# Altium schematic sheet Sheet1.SchDoc
size A4 portrait
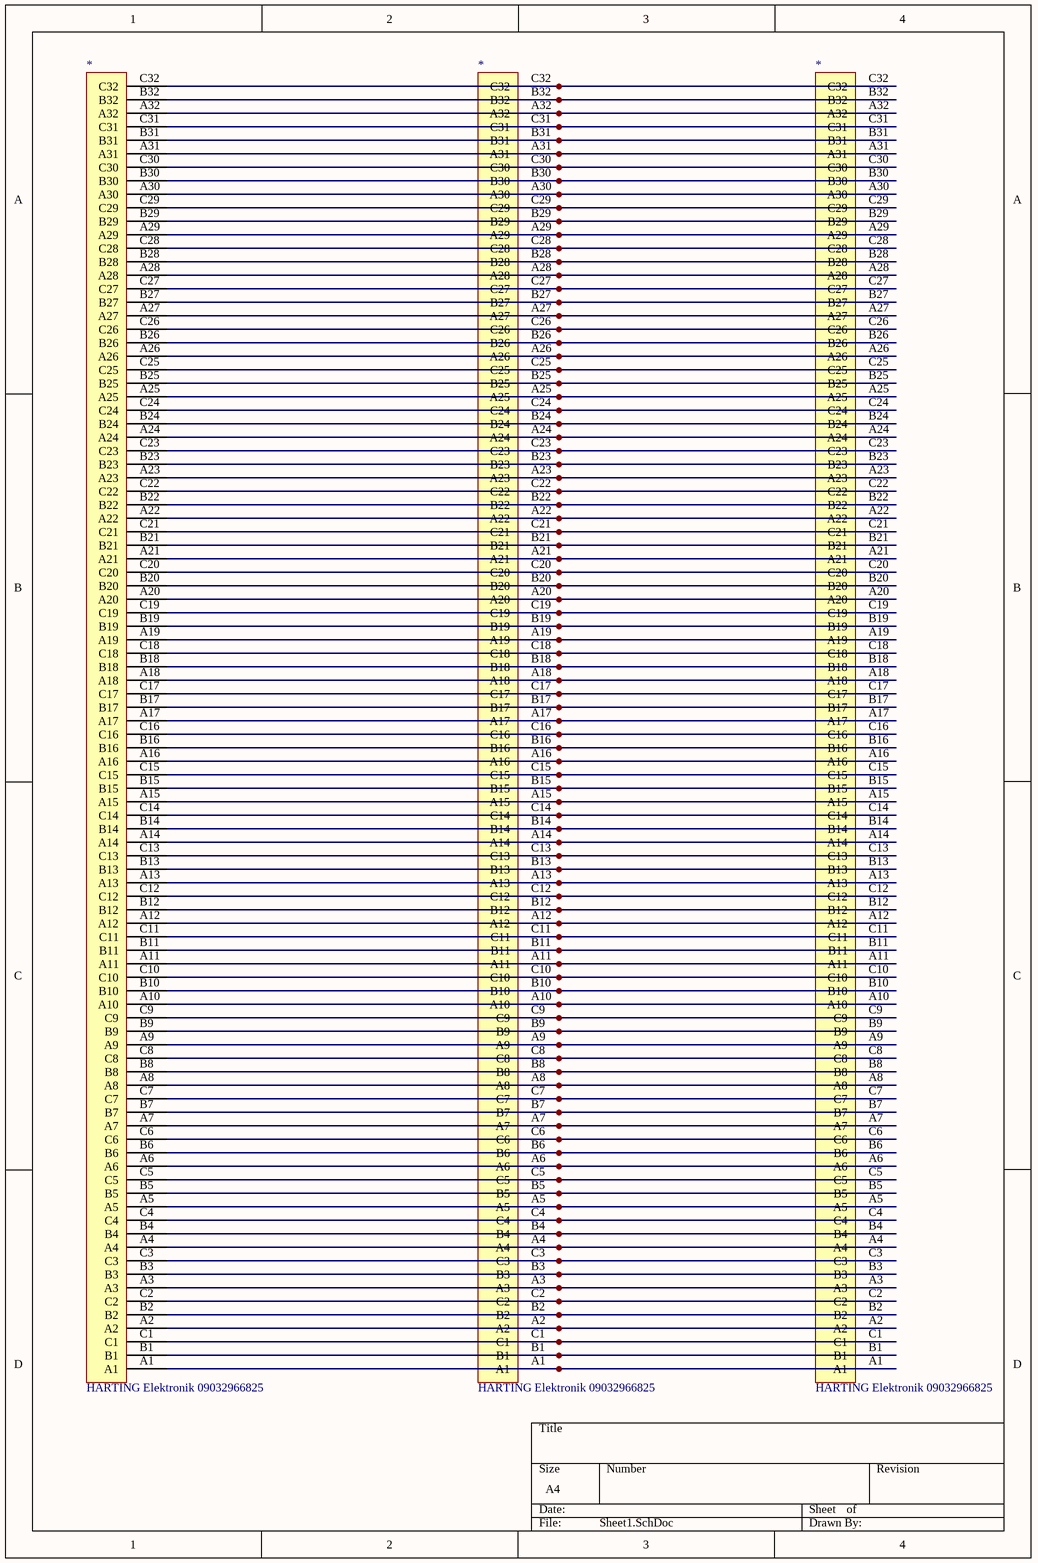
[diagram p0: Sheet1.SchDoc]

## Parts
(Parts that share a designator on the sheet are numbered #1, #2 ... from top to bottom, then left to right.)
*#1  HARTING Elektronik 09032966825  [PCB-fl6umf7voephrqnacxyd-1]
*#2  HARTING Elektronik 09032966825  [PCB-ecf4e4ae5cfbczwsc9zy-1]
*#3  HARTING Elektronik 09032966825  [PCB-ecf4e4ae5cfbczwsc9zy-1]

## Nets
Net*#1_A1: *#1.A1 *#2.A1 *#3.A1
Net*#1_A2: *#1.A2 *#2.A2 *#3.A2
Net*#1_A3: *#1.A3 *#2.A3 *#3.A3
Net*#1_A4: *#1.A4 *#2.A4 *#3.A4
Net*#1_A5: *#1.A5 *#2.A5 *#3.A5
Net*#1_A6: *#1.A6 *#2.A6 *#3.A6
Net*#1_A7: *#1.A7 *#2.A7 *#3.A7
Net*#1_A8: *#1.A8 *#2.A8 *#3.A8
Net*#1_A9: *#1.A9 *#2.A9 *#3.A9
Net*#1_A10: *#1.A10 *#2.A10 *#3.A10
Net*#1_A11: *#1.A11 *#2.A11 *#3.A11
Net*#1_A12: *#1.A12 *#2.A12 *#3.A12
Net*#1_A13: *#1.A13 *#2.A13 *#3.A13
Net*#1_A14: *#1.A14 *#2.A14 *#3.A14
Net*#1_A15: *#1.A15 *#2.A15 *#3.A15
Net*#1_A16: *#1.A16 *#2.A16 *#3.A16
Net*#1_A17: *#1.A17 *#2.A17 *#3.A17
Net*#1_A18: *#1.A18 *#2.A18 *#3.A18
Net*#1_A19: *#1.A19 *#2.A19 *#3.A19
Net*#1_A20: *#1.A20 *#2.A20 *#3.A20
Net*#1_A21: *#1.A21 *#2.A21 *#3.A21
Net*#1_A22: *#1.A22 *#2.A22 *#3.A22
Net*#1_A23: *#1.A23 *#2.A23 *#3.A23
Net*#1_A24: *#1.A24 *#2.A24 *#3.A24
Net*#1_A25: *#1.A25 *#2.A25 *#3.A25
Net*#1_A26: *#1.A26 *#2.A26 *#3.A26
Net*#1_A27: *#1.A27 *#2.A27 *#3.A27
Net*#1_A28: *#1.A28 *#2.A28 *#3.A28
Net*#1_A29: *#1.A29 *#2.A29 *#3.A29
Net*#1_A30: *#1.A30 *#2.A30 *#3.A30
Net*#1_A31: *#1.A31 *#2.A31 *#3.A31
Net*#1_A32: *#1.A32 *#2.A32 *#3.A32
Net*#1_B1: *#1.B1 *#2.B1 *#3.B1
Net*#1_B2: *#1.B2 *#2.B2 *#3.B2
Net*#1_B3: *#1.B3 *#2.B3 *#3.B3
Net*#1_B4: *#1.B4 *#2.B4 *#3.B4
Net*#1_B5: *#1.B5 *#2.B5 *#3.B5
Net*#1_B6: *#1.B6 *#2.B6 *#3.B6
Net*#1_B7: *#1.B7 *#2.B7 *#3.B7
Net*#1_B8: *#1.B8 *#2.B8 *#3.B8
Net*#1_B9: *#1.B9 *#2.B9 *#3.B9
Net*#1_B10: *#1.B10 *#2.B10 *#3.B10
Net*#1_B11: *#1.B11 *#2.B11 *#3.B11
Net*#1_B12: *#1.B12 *#2.B12 *#3.B12
Net*#1_B13: *#1.B13 *#2.B13 *#3.B13
Net*#1_B14: *#1.B14 *#2.B14 *#3.B14
Net*#1_B15: *#1.B15 *#2.B15 *#3.B15
Net*#1_B16: *#1.B16 *#2.B16 *#3.B16
Net*#1_B17: *#1.B17 *#2.B17 *#3.B17
Net*#1_B18: *#1.B18 *#2.B18 *#3.B18
Net*#1_B19: *#1.B19 *#2.B19 *#3.B19
Net*#1_B20: *#1.B20 *#2.B20 *#3.B20
Net*#1_B21: *#1.B21 *#2.B21 *#3.B21
Net*#1_B22: *#1.B22 *#2.B22 *#3.B22
Net*#1_B23: *#1.B23 *#2.B23 *#3.B23
Net*#1_B24: *#1.B24 *#2.B24 *#3.B24
Net*#1_B25: *#1.B25 *#2.B25 *#3.B25
Net*#1_B26: *#1.B26 *#2.B26 *#3.B26
Net*#1_B27: *#1.B27 *#2.B27 *#3.B27
Net*#1_B28: *#1.B28 *#2.B28 *#3.B28
Net*#1_B29: *#1.B29 *#2.B29 *#3.B29
Net*#1_B30: *#1.B30 *#2.B30 *#3.B30
Net*#1_B31: *#1.B31 *#2.B31 *#3.B31
Net*#1_B32: *#1.B32 *#2.B32 *#3.B32
Net*#1_C1: *#1.C1 *#2.C1 *#3.C1
Net*#1_C2: *#1.C2 *#2.C2 *#3.C2
Net*#1_C3: *#1.C3 *#2.C3 *#3.C3
Net*#1_C4: *#1.C4 *#2.C4 *#3.C4
Net*#1_C5: *#1.C5 *#2.C5 *#3.C5
Net*#1_C6: *#1.C6 *#2.C6 *#3.C6
Net*#1_C7: *#1.C7 *#2.C7 *#3.C7
Net*#1_C8: *#1.C8 *#2.C8 *#3.C8
Net*#1_C9: *#1.C9 *#2.C9 *#3.C9
Net*#1_C10: *#1.C10 *#2.C10 *#3.C10
Net*#1_C11: *#1.C11 *#2.C11 *#3.C11
Net*#1_C12: *#1.C12 *#2.C12 *#3.C12
Net*#1_C13: *#1.C13 *#2.C13 *#3.C13
Net*#1_C14: *#1.C14 *#2.C14 *#3.C14
Net*#1_C15: *#1.C15 *#2.C15 *#3.C15
Net*#1_C16: *#1.C16 *#2.C16 *#3.C16
Net*#1_C17: *#1.C17 *#2.C17 *#3.C17
Net*#1_C18: *#1.C18 *#2.C18 *#3.C18
Net*#1_C19: *#1.C19 *#2.C19 *#3.C19
Net*#1_C20: *#1.C20 *#2.C20 *#3.C20
Net*#1_C21: *#1.C21 *#2.C21 *#3.C21
Net*#1_C22: *#1.C22 *#2.C22 *#3.C22
Net*#1_C23: *#1.C23 *#2.C23 *#3.C23
Net*#1_C24: *#1.C24 *#2.C24 *#3.C24
Net*#1_C25: *#1.C25 *#2.C25 *#3.C25
Net*#1_C26: *#1.C26 *#2.C26 *#3.C26
Net*#1_C27: *#1.C27 *#2.C27 *#3.C27
Net*#1_C28: *#1.C28 *#2.C28 *#3.C28
Net*#1_C29: *#1.C29 *#2.C29 *#3.C29
Net*#1_C30: *#1.C30 *#2.C30 *#3.C30
Net*#1_C31: *#1.C31 *#2.C31 *#3.C31
Net*#1_C32: *#1.C32 *#2.C32 *#3.C32

## Library data of the parts
*#1 = 09032966825: Conn DIN 41612 F 96 POS 2.54mm Solder ST Thru-Hole Box; Number of Mating Cycles: 400; Gender: Female; Current Rating: 2.00 A; Number of Positions: 96; Lead-Free Status: Lead Free; Material: Polyester; Orientation: Straight; Pin Pitch: 2.54 mm; OctopartID: a70e6e0450a678c9; Packaging: Tray; Number of Rows: 3; RoHS: Compliant; REACH SVHC Compliance: No SVHC; Contact Plating: Gold; Flammability Rating: UL 94 V-0; Contact Material: Copper; Operating Temperature: -65.0 °C (min)
*#2 *#3 = 09031966921: Connector Din 41612 96P 2A Male R/a Sldr; Number of Contacts: 96; Material: Polyester; Orientation: Right Angle; Packaging: Bag; Number of Pins: 96; Size-Length: 87.5 mm